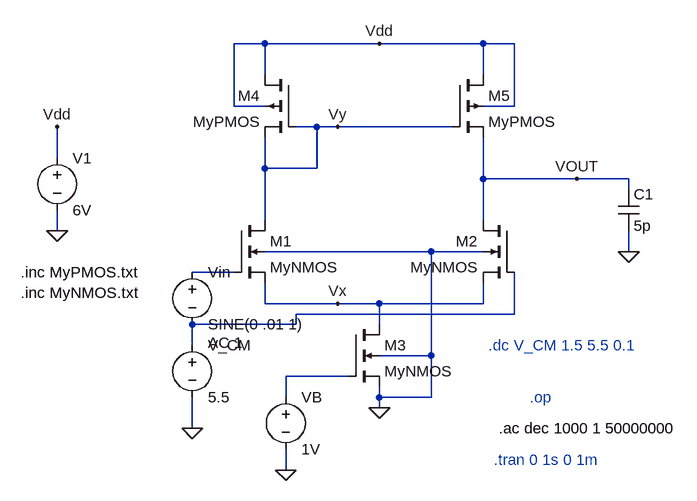
[diagram p0: schematic hw7 differential amp.asc]
hw7 differential amp.asc, the LTspice schematic file:
Version 4.1
SHEET 1 1024 680
WIRE 368 -48 320 -48
WIRE 544 -48 368 -48
WIRE 704 -48 544 -48
WIRE 752 -48 704 -48
WIRE 368 0 368 -48
WIRE 704 0 704 -48
WIRE 320 48 320 -48
WIRE 368 48 320 48
WIRE 752 48 752 -48
WIRE 752 48 704 48
WIRE 448 80 416 80
WIRE 480 80 448 80
WIRE 656 80 480 80
WIRE 48 128 48 80
WIRE 368 144 368 96
WIRE 448 144 448 80
WIRE 448 144 368 144
WIRE 704 160 704 96
WIRE 848 160 704 160
WIRE 928 160 848 160
WIRE 928 176 928 160
WIRE 368 224 368 144
WIRE 704 224 704 160
WIRE 48 240 48 208
WIRE 624 272 368 272
WIRE 704 272 624 272
WIRE 928 272 928 240
WIRE 320 304 256 304
WIRE 368 352 368 320
WIRE 480 352 368 352
WIRE 544 352 480 352
WIRE 704 352 704 320
WIRE 704 352 544 352
WIRE 752 368 752 304
WIRE 752 368 416 368
WIRE 416 384 416 368
WIRE 416 384 256 384
WIRE 544 384 544 352
WIRE 256 416 256 384
WIRE 624 432 624 272
WIRE 624 432 544 432
WIRE 496 464 400 464
WIRE 400 496 400 464
WIRE 544 496 544 480
WIRE 624 496 624 432
WIRE 624 496 544 496
WIRE 544 512 544 496
WIRE 256 544 256 496
WIRE 400 608 400 576
FLAG 48 240 0
FLAG 48 80 Vdd
FLAG 544 -48 Vdd
FLAG 544 512 0
FLAG 400 608 0
FLAG 928 272 0
FLAG 848 160 VOUT
FLAG 480 80 Vy
FLAG 480 352 Vx
FLAG 256 544 0
SYMBOL voltage 48 112 R0
WINDOW 123 0 0 Left 0
WINDOW 39 0 0 Left 0
SYMATTR InstName V1
SYMATTR Value 6V
SYMBOL pmos4 656 0 R0
SYMATTR InstName M5
SYMATTR Value MyPMOS
SYMATTR Value2 l=0.5u w=1.7u
SYMBOL pmos4 416 0 M0
SYMATTR InstName M4
SYMATTR Value MyPMOS
SYMATTR Value2 l=0.5u w=1.7u
SYMBOL nmos4 320 224 R0
SYMATTR InstName M1
SYMATTR Value MyNMOS
SYMATTR Value2 l=0.5u w=20u
SYMBOL nmos4 752 224 M0
SYMATTR InstName M2
SYMATTR Value MyNMOS
SYMATTR Value2 l=0.5u w=20u
SYMBOL nmos4 496 384 R0
SYMATTR InstName M3
SYMATTR Value MyNMOS
SYMATTR Value2 l=0.5u w=1.53u
SYMBOL voltage 400 480 R0
WINDOW 123 0 0 Left 0
WINDOW 39 0 0 Left 0
SYMATTR InstName VB
SYMATTR Value 1V
SYMBOL cap 912 176 R0
SYMATTR InstName C1
SYMATTR Value 5p
SYMBOL voltage 256 400 R0
WINDOW 123 0 0 Left 0
WINDOW 39 0 0 Left 0
SYMATTR InstName V_CM
SYMATTR Value 5.5
SYMBOL voltage 256 288 R0
WINDOW 123 24 124 Left 2
WINDOW 39 0 0 Left 0
SYMATTR InstName Vin
SYMATTR Value SINE(0 .01 1)
SYMATTR Value2 AC 1
TEXT -8 304 Left 2 !.inc MyPMOS.txt\n.inc MyNMOS.txt
TEXT 712 416 Left 2 ;.dc V_CM 1.5 5.5 0.1
TEXT 776 496 Left 2 ;.op
TEXT 720 592 Left 2 ;.tran 0 1s 0 1m
TEXT 728 544 Left 2 !.ac dec 1000 1 50000000

The netlist it stands for:
* hw7 differential amp.asc
V1 Vdd 0 6V
M5 Vdd Vy VOUT Vdd MyPMOS l=0.5u w=1.7u
M4 Vdd Vy Vy Vdd MyPMOS l=0.5u w=1.7u
M1 Vy N001 Vx 0 MyNMOS l=0.5u w=20u
M2 VOUT N002 Vx 0 MyNMOS l=0.5u w=20u
M3 Vx N003 0 0 MyNMOS l=0.5u w=1.53u
VB N003 0 1V
C1 VOUT 0 5p
V_CM N002 0 5.5
Vin N001 N002 SINE(0 .01 1) AC 1
.model NMOS NMOS
.model PMOS PMOS
.lib standard.mos
.inc MyPMOS.txt
.inc MyNMOS.txt
* .dc V_CM 1.5 5.5 0.1
* .op
* .tran 0 1s 0 1m
.ac dec 1000 1 50000000
.backanno
.end